# Altium schematic sheet Analog Inputs 0-7.SchDoc: Ravage - Analog Inputs 0-7
size A4; Address1: Drawn By:; Address2: Dan Visser; DocumentNumber: A; Revision: 0.2
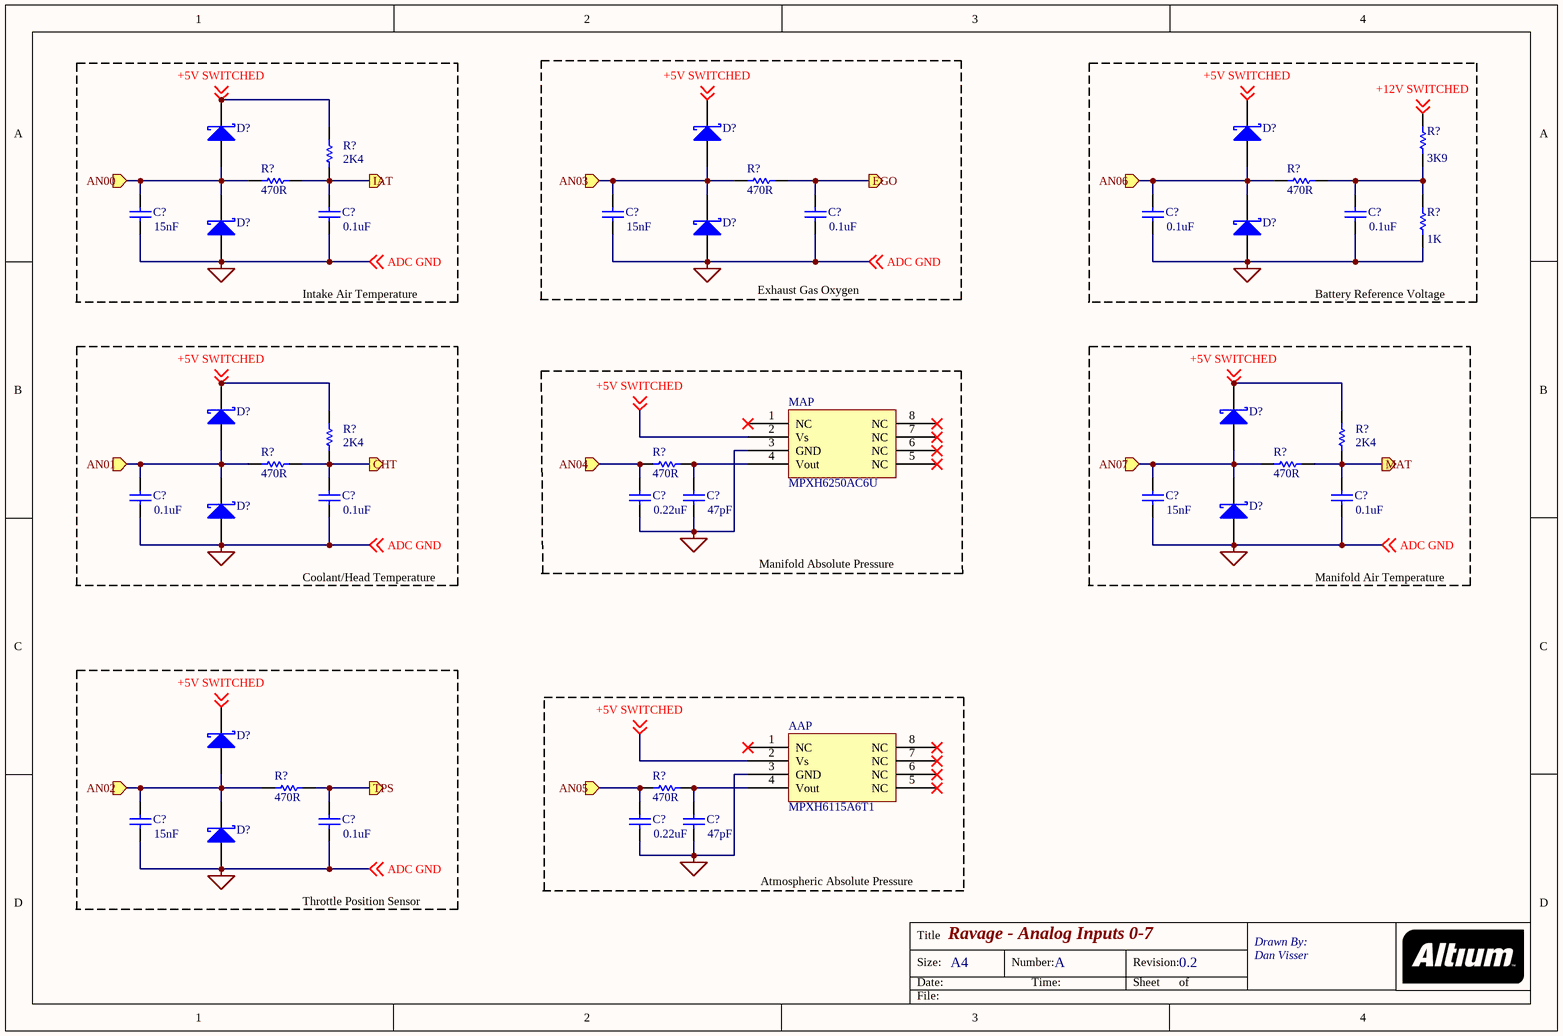
[diagram p0: Analog Inputs 0-7.SchDoc]

## Parts
(Parts that share a designator on the sheet are numbered #1, #2 ... from top to bottom, then left to right.)
AAP  MPXH6115A6T1
C?#1  value 15nF  [RAD-0.3]
C?#2  value 0.1uF  [RAD-0.3]
C?#3  value 15nF  [RAD-0.3]
C?#4  value 0.1uF  [RAD-0.3]
C?#5  value 0.1uF  [RAD-0.3]
C?#6  value 0.1uF  [RAD-0.3]
C?#7  value 0.1uF  [RAD-0.3]
C?#8  value 0.1uF  [RAD-0.3]
C?#9  value 0.22uF  [RAD-0.3]
C?#10  value 47pF  [RAD-0.3]
C?#11  value 15nF  [RAD-0.3]
C?#12  value 0.1uF  [RAD-0.3]
C?#13  value 15nF  [RAD-0.3]
C?#14  value 0.1uF  [RAD-0.3]
C?#15  value 0.22uF  [RAD-0.3]
C?#16  value 47pF  [RAD-0.3]
D?#1  (no value)  [TO-220AC]
D?#2  (no value)  [TO-220AC]
D?#3  (no value)  [TO-220AC]
D?#4  (no value)  [TO-220AC]
D?#5  (no value)  [TO-220AC]
D?#6  (no value)  [TO-220AC]
D?#7  (no value)  [TO-220AC]
D?#8  (no value)  [TO-220AC]
D?#9  (no value)  [TO-220AC]
D?#10  (no value)  [TO-220AC]
D?#11  (no value)  [TO-220AC]
D?#12  (no value)  [TO-220AC]
MAP  MPXH6250AC6U
R?#1  value 2K4  [AXIAL-0.3]
R?#2  value 3K9  [AXIAL-0.3]
R?#3  value 470R  [AXIAL-0.3]
R?#4  value 470R  [AXIAL-0.3]
R?#5  value 470R  [AXIAL-0.3]
R?#6  value 1K  [AXIAL-0.3]
R?#7  value 2K4  [AXIAL-0.3]
R?#8  value 2K4  [AXIAL-0.3]
R?#9  value 470R  [AXIAL-0.3]
R?#10  value 470R  [AXIAL-0.3]
R?#11  value 470R  [AXIAL-0.3]
R?#12  value 470R  [AXIAL-0.3]
R?#13  value 470R  [AXIAL-0.3]

## Blocks framed on the sheet
Intake Air Temperature: C?#1 C?#2 D?#1 D?#4 R?#1 R?#3
Exhaust Gas Oxygen: C?#3 C?#4 D?#2 D?#5 R?#4
Battery Reference Voltage: C?#5 C?#6 D?#3 D?#6 R?#2 R?#5 R?#6
Coolant/Head Temperature: C?#7 C?#8 D?#7 D?#9 R?#7 R?#9
Manifold Air Temperature: C?#11 C?#12 D?#8 D?#10 R?#8 R?#11
Manifold Absolute Pressure: C?#9 C?#10 MAP R?#10
Throttle Position Sensor: C?#13 C?#14 D?#11 D?#12 R?#12
Atmospheric Absolute Pressure: AAP C?#15 C?#16 R?#13

## Ports
AN00 (in), AN01 (in), AN02 (in), AN03 (in), AN04 (in), AN05 (in), AN06 (in), AN07 (in), CHT (out), EGO (out), IAT (out), MAT (out), TPS (out)

## Nets
ADC GND: AAP.3(GND) C?#1.1 C?#2.1 C?#3.1 C?#4.1 C?#5.1 C?#6.1 C?#7.1 C?#8.1 C?#9.1 C?#10.1 C?#11.1 C?#12.1 C?#13.1 C?#14.1 C?#15.1 C?#16.1 D?#4.3(A) D?#5.3(A) D?#6.3(A) D?#9.3(A) D?#10.3(A) D?#12.3(A) MAP.3(GND) R?#6.1 ; off-sheet ADC GND
+5V SWITCHED: AAP.2(Vs) D?#1.1(K) D?#2.1(K) D?#3.1(K) D?#7.1(K) D?#8.1(K) D?#11.1(K) MAP.2(Vs) R?#1.1 R?#7.1 R?#8.1 ; off-sheet +5V SWITCHED
+12V SWITCHED: R?#2.2 ; off-sheet +12V SWITCHED
AN00: C?#1.2 D?#1.3(A) D?#4.1(K) R?#3.1 ; port AN00
AN01: C?#7.2 D?#7.3(A) D?#9.1(K) R?#9.1 ; port AN01
AN02: C?#13.2 D?#11.3(A) D?#12.1(K) R?#12.1 ; port AN02
AN03: C?#3.2 D?#2.3(A) D?#5.1(K) R?#4.1 ; port AN03
AN04: C?#9.2 R?#10.1 ; port AN04
AN05: C?#15.2 R?#13.1 ; port AN05
AN06: C?#5.2 D?#3.3(A) D?#6.1(K) R?#5.1 ; port AN06
AN07: C?#11.2 D?#8.3(A) D?#10.1(K) R?#11.1 ; port AN07
CHT: C?#8.2 R?#7.2 R?#9.2 ; port CHT
EGO: C?#4.2 R?#4.2 ; port EGO
IAT: C?#2.2 R?#1.2 R?#3.2 ; port IAT
MAT: C?#12.2 R?#8.2 R?#11.2 ; port MAT
TPS: C?#14.2 R?#12.2 ; port TPS
NetAAP_4: AAP.4(Vout) C?#16.2 R?#13.2
NetC?#6_2: C?#6.2 R?#2.1 R?#5.2 R?#6.2
NetC?#10_2: C?#10.2 MAP.4(Vout) R?#10.2

Not connected (* = marked no-connect by the designer): AAP 1(NC)* 5(NC)* 6(NC)* 7(NC)* 8(NC)*; MAP 1(NC)* 5(NC)* 6(NC)* 7(NC)* 8(NC)*

## Notes on the sheet
- Title
- Size:
- Date:
- A4
- Number:
- Time:
- Revision:
- Sheet
- of
- File:

## Library data of the parts
C?#1-C?#16 = Cap: Capacitor; Published: 8-Jun-2000; LatestRevisionDate: 17-Jul-2002; LatestRevisionNote: Re-released for DXP Platform.; PackageReference: RAD-0.3; Publisher: Altium Limited; PackageDescription: Radial Cap, Thru-Hole; 2 Leads; 0.3 in Pin Spacing
D?#1-D?#12 = Diode 18TQ045: Schottky Rectifier; Note: Terminal 2 is the TAB and is electrically connected to the cathode; Published: 8-Jun-2000; LatestRevisionDate: 17-Jul-2002; LatestRevisionNote: Re-released for DXP Platform.; DatasheetVersion: Dec-1997; PackageVersion: Feb-1998; PackageReference: TO-220AC; Publisher: Altium Limited; PackageDescription: TO, Thru-Hole, Vertical, Heatsink Mounted; 3 In-Line Leads (1 Absent); Pitch 2.54 mm; ComponentLink1Description: Manufacturer Link; ComponentLink1URL: http://www.irf.com/; ComponentLink2Description: Datasheet; ComponentLink2URL: http://www.irf.com/product-info/datasheets/data/18tq.pdf
R?#1-R?#13 = Res1: Resistor; Published: 8-Jun-2000; LatestRevisionDate: 17-Jul-2002; LatestRevisionNote: Re-released for DXP Platform.; PackageReference: AXIAL-0.3; Publisher: Altium Limited; PackageDescription: Axial Device, Thru-Hole; 2 Leads; 0.3 in Pin Spacing